# EAGLE design FTDI (EAGLE 5.06)
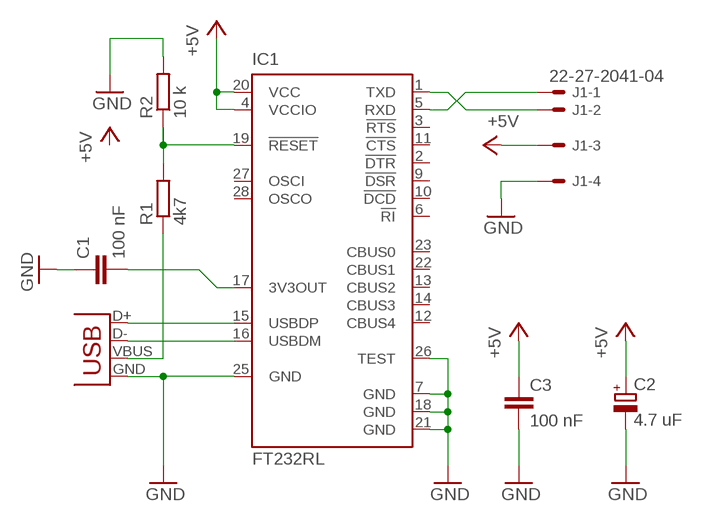
[diagram p0: schematic, sheet 1]

## Parts
C1  100 nF  C-EUC0805K  [C0805K]
C2  4.7 uF  CPOL-EUE5-4  [E5-4]
C3  100 nF  C-EUC0805K  [C0805K]
IC1  FT232RL  [SSOP28]
J1  22-27-2041-04  [6410-04]
R1  4k7  R-EU_R0805  [R0805]
R2  10 k  R-EU_R0805  [R0805]
X1  USBPTH  [USB-B-PTH]

## Nets
+5V: C2.+ C3.1 IC1.4(VCCIO) IC1.20(VCC) J1.3
GND: C1.1 C2.- C3.2 IC1.7(GND) IC1.18(GND) IC1.21(GND) IC1.25(GND) IC1.26(TEST) J1.4 R2.2 X1.GND
N$1: IC1.1(TXD) J1.2
N$2: IC1.15(USBDP) X1.D+
N$3: IC1.16(USBDM) X1.D-
N$4: R1.1 X1.VBUS
N$5: IC1.5(RXD) J1.1
N$9: C1.2 IC1.17(3V3OUT)
N$11: IC1.19(!RESET) R1.2 R2.1
Unconnected: IC1.2(!DTR) IC1.3(!RTS) IC1.6(!RI) IC1.9(!DSR) IC1.10(!DCD) IC1.11(!CTS) IC1.12(CBUS4) IC1.13(CBUS2) IC1.14(CBUS3) IC1.22(CBUS1) IC1.23(CBUS0) IC1.27(OSCI) IC1.28(OSCO)

## Library data of the parts
C1 C3 = rcl:C-EU: CAPACITOR, European symbol
C2 = rcl:CPOL-EU: POLARIZED CAPACITOR, European symbol
IC1 = ftdichip:FT232R: Source: http://www.ftdichip.com/Documents/DataSheets/DS_FT232R_v104.pdf
J1 = con-molex:22-?-04: CONNECTOR wire to board 2.54 mm (.1 inch) pitch header
R1 R2 = rcl:R-EU_: RESISTOR, European symbol
X1 = SparkFun:USB: USB Connectors USB-B-PTH is fully proven SKU : PRT-00139 USB-miniB is fully proven SKU : PRT-00587 USB-A-PCB is untested. USB-A-H is throughly reviewed, but untested. Spark Fun Electronics SKU : PRT-00437 USB-B-SMT is throughly reviewed, but untested. Needs silkscreen touching up. USB-A-S has not been used/tested USB-MB-H has not been used/tested

## Board
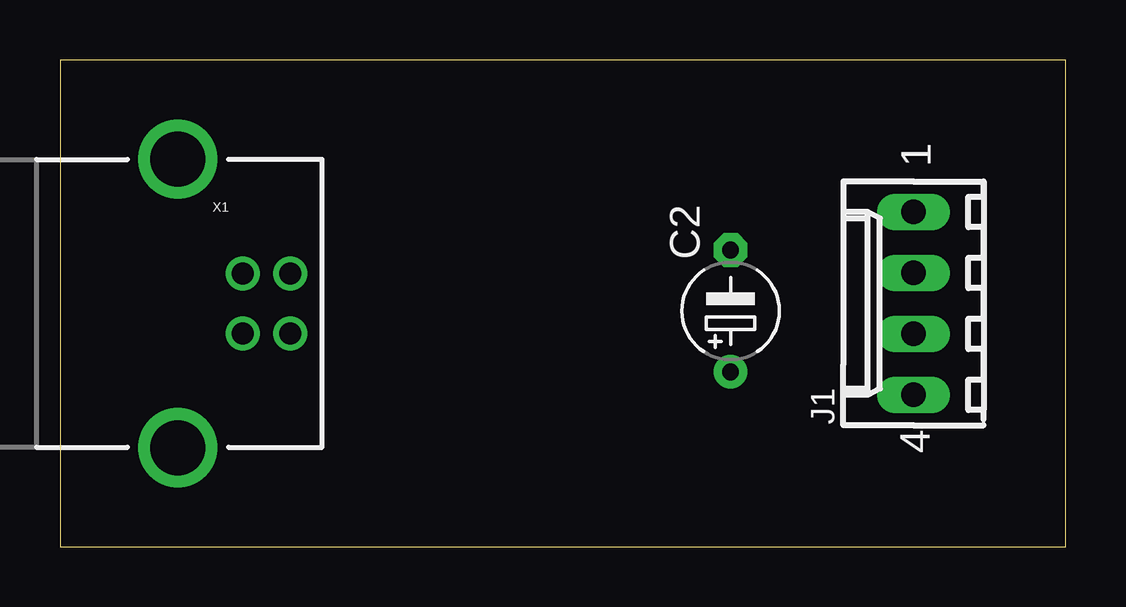
[diagram p1: board, top side]
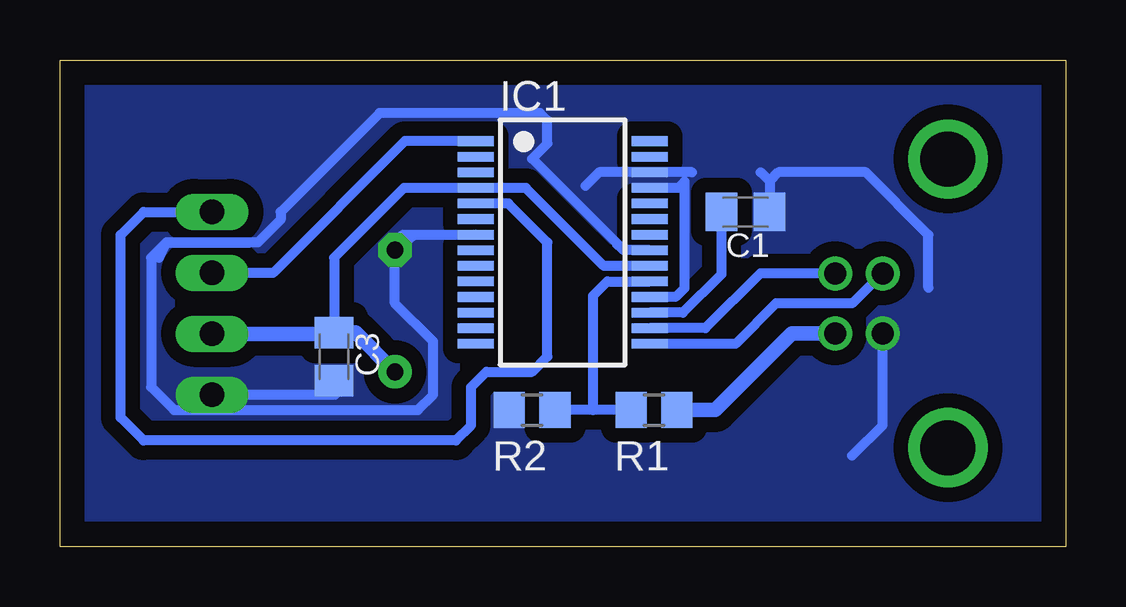
[diagram p2: board, bottom side, seen from below]

Size 41.9 x 20.31 mm. Coordinates in mm from the lower left corner, seen from the top.
Outline: 0,0 41.9,0 41.9,20.31 0,20.31 0,0
Copper layers (1*16): Top 0.035mm / dielectric 1.5mm / Bottom 0.035mm
Design rules "default": minimum track width 10mil, minimum drill 24mil, track to track 8mil, track to pad 8mil, pad to pad 8mil, via to via 8mil, smd to smd 8mil, copper to edge 40mil, drill to drill 8mil, minimum pad ring 10mil, minimum via ring 8mil, stop-mask expansion 4mil, vias tented up to drill 0mil, thermal gap 10mil

### Footprints (pad centres in the part's own frame; a part is rotated, then mirrored left to right if it is on the bottom)
C0805K = smd 1.3 x 1.6: 1 -1,0; 2 1,0
E5-4 = drill 0.7 pad 1.4 round: + -2.54,0 | drill 0.7 pad 1.4 octagon: - 2.54,0
SSOP28 = smd 0.4 x 1.5: 1 -4.225,-3.625; 2 -3.575,-3.625; 3 -2.925,-3.625; 4 -2.275,-3.625; 5 -1.625,-3.625; 6 -0.975,-3.625; 7 -0.325,-3.625; 8 0.325,-3.625; 9 0.975,-3.625; 10 1.625,-3.625; 11 2.275,-3.625; 12 2.925,-3.625; 13 3.575,-3.625; 14 4.225,-3.625; 15 4.225,3.625; 16 3.575,3.625; 17 2.925,3.625; 18 2.275,3.625; 19 1.625,3.625; 20 0.975,3.625; 21 0.325,3.625; 22 -0.325,3.625; 23 -0.975,3.625; 24 -1.625,3.625; 25 -2.275,3.625; 26 -2.925,3.625; 27 -3.575,3.625; 28 -4.225,3.625
6410-04 = drill 1.016 long: 1 3.81,0; 2 1.27,0; 3 -1.27,0; 4 -3.81,0
R0805 = smd 1.3 x 1.5: 1 -0.95,0; 2 0.95,0
USB-B-PTH = drill 0.914 round: D+ 0,1.25; D- 1.981,1.25; GND 0,-1.25; VBUS 1.981,-1.25 | drill 2.286 round: P$1 -2.718,-6.02; P$2 -2.718,6.02

### Placement (x,y rotation side)
C1  13.33,13.97 180 bottom
C2  27.94,9.84 90 top
C3  30.48,7.94 270 bottom
IC1  20.95,12.7 270 bottom
J1  35.56,10.16 90 top
R1  17.15,5.71 180 bottom
R2  22.23,5.71 180 bottom
X1  7.62,10.16 0 top

### Tracks (layer width: path | path; a pad name or v marks a point on that pad's centre or on a via)
+5V
  Bottom 0.406: IC1.20 19.24,11.72 22.49,14.97 IC1.4 27.57,14.97 30.48,12.07 C3.1
  Bottom 0.61: J1.3 30.53,8.89 C3.1 | C3.1 30.53,8.94 | C3.1 29.57,8.94 C2.+
GND
  Bottom 0.406: 15.56,15.63 IC1.26 19.44,15.63 20,15.06 | 5.71,10.82 5.71,13.02 8.32,15.63 11.97,15.63 12.33,15.26 | 12.33,15.26 C1.1 | 12.33,15.26 12.7,15.63 | IC1.18 16.24,10.43 15.88,10.79 15.88,15.24 16.14,14.97 IC1.25 | J1.4 30.53,6.35 C3.2 30.43,6.35 | C2.- 27.13,13.02 IC1.7 27.62,13.03 27.94,12.7 27.94,10.16 26.35,8.57 26.35,6.35 26.99,5.71 37.15,5.71 38.1,6.67 38.1,12.07 37.46,12.7 | X1.GND 7.62,5.08 8.89,3.81 | 18.41,12.38 18.73,12.7 | IC1.21 18.41,12.38 | 18.41,12.38 22.23,16.19 21.59,16.83 21.59,17.78 21.91,18.1 28.57,18.1 32.7,13.97 32.7,13.65 33.66,12.7 37.46,12.7 | 37.46,12.7 33.97,12.7 | 37.46,12.7 37.78,12.07
  pour Bottom (isolate 0.61, no thermals): 0,19.05 40.96,19.05 40.96,1.27 0,1.27
N$1
  Bottom 0.406: IC1.1 27.52,16.93 33.02,11.43 J1.2
N$2
  Bottom 0.406: X1.D+ 7.64,11.41 8.89,10.16 12.06,10.16 13.75,8.47 IC1.15
N$3
  Bottom 0.406: IC1.16 15.01,9.13 12.72,11.41 X1.D-
N$4
  Bottom 0.61: X1.VBUS 11.41,8.91 14.6,5.71 R1.1
N$5
  Bottom 0.406: IC1.5 23.22,14.32 21.59,12.7 21.59,7.94 22.23,7.3 24.13,7.3 24.77,6.67 24.77,5.08 25.4,4.45 38.42,4.45 39.37,5.4 39.37,13.02 38.42,13.97 J1.1
N$9
  Bottom 0.406: IC1.17 15.94,9.78 14.33,11.38 C1.2
N$11
  Bottom 0.406: R1.2 19.69,5.71 | 19.69,5.71 R2.1 | IC1.19 19.09,11.07 19.69,10.48 19.69,5.71